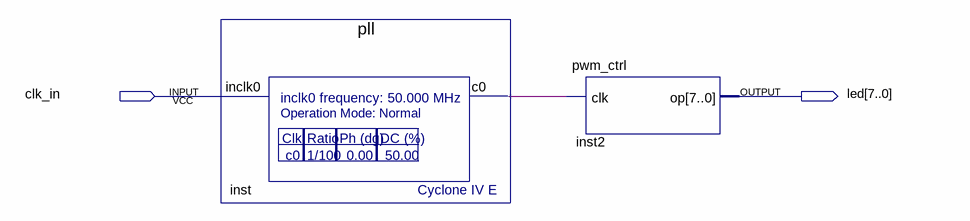
[diagram p0: schematic sheet]
// Quartus schematic pwm.bdf as structural Verilog: 2 symbols, 2 pins
module pwm (
  input  clk_in,
  output [7:0] led
);

  wire inst_c0;

  pll inst (.inclk0(clk_in), .c0(inst_c0));
  pwm_ctrl inst2 (.clk(inst_c0), .op(led));
endmodule
